# Altium schematic sheet ESP_Mian.SchDoc
size A4
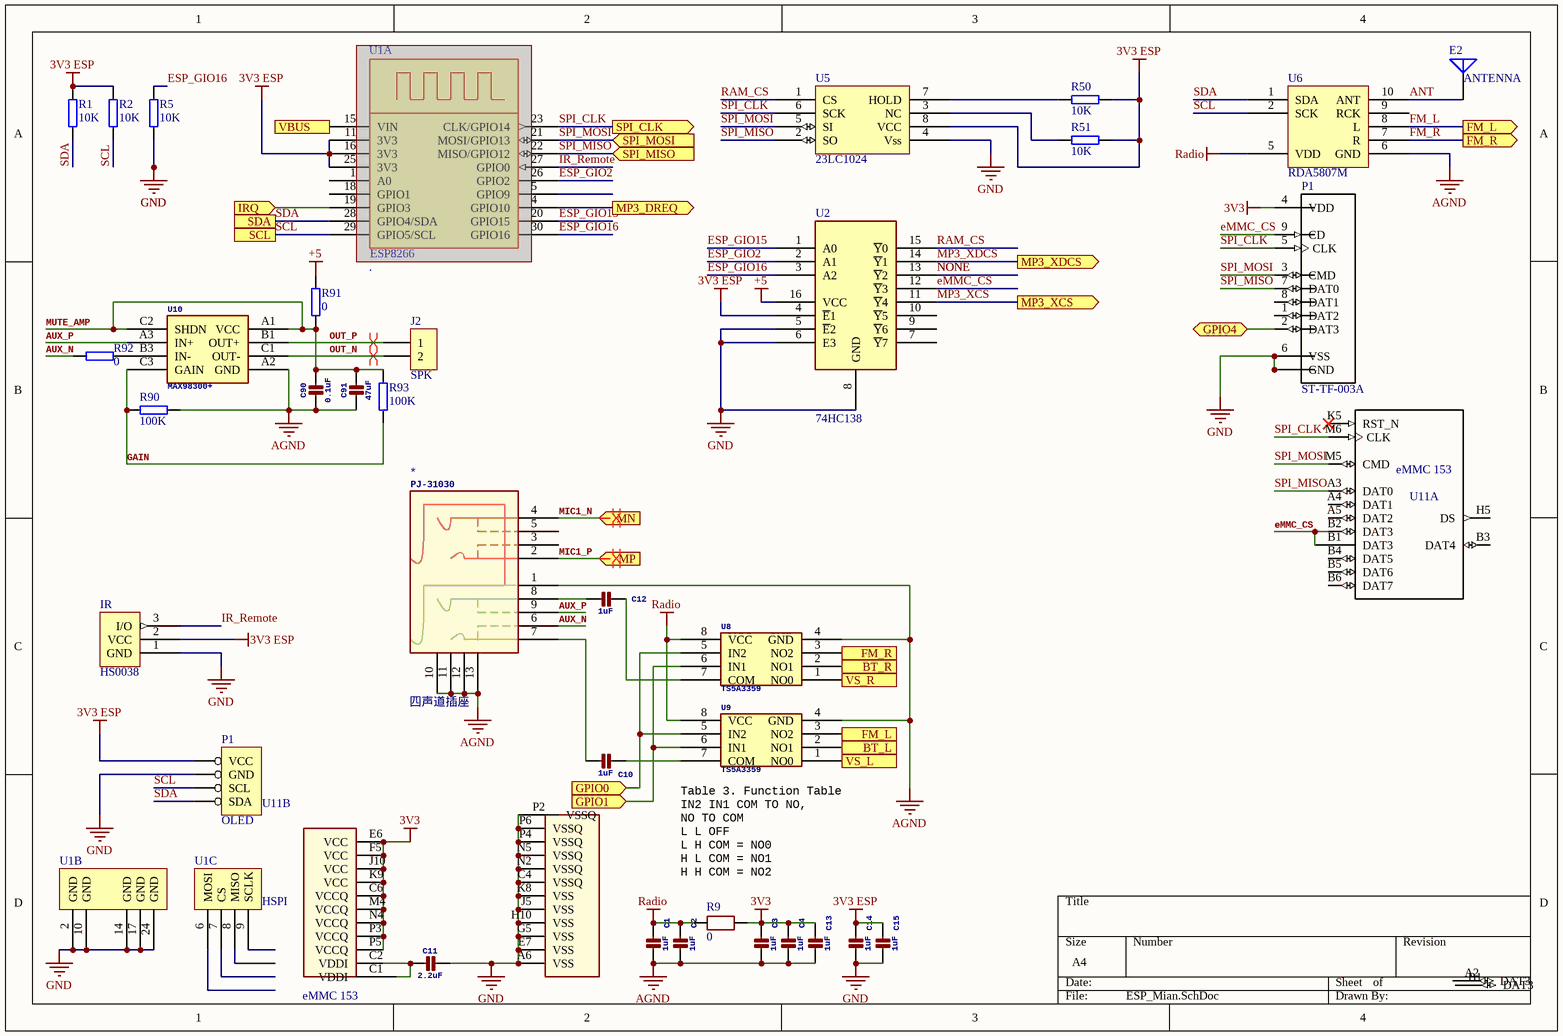
[diagram p0: ESP_Mian.SchDoc]

## Parts
(Parts that share a designator on the sheet are numbered #1, #2 ... from top to bottom, then left to right.)
*  四声道插座  [pj-31030]
C1  1uF  [1206]
C2  1uF  [1206]
C3  1uF  [1206]
C4  1uF  [1206]
C10  1uF  [1206]
C11  2.2uF  [0603]
C12  1uF  [1206]
C13  1uF  [0603AC]
C14  1uF  [1206]
C15  1uF  [1206]
C90  0.1uF  [0201]
C91  47uF  [_0805MP]
E2  ANTENNA  [P125-B]
IR  HS0038  [SIP03]
J2  SPK  [SIP2_1]
P1#1  ST-TF-003A  [*SUNTECH_ST-TF-003A_ST-TF-003A(Primary)]
P1#2  OLED  [SIP4]
R1  10K  [0805]
R2  10K  [0805]
R5  10K  [0603]
R9  0  [0603AR]
R50  10K  [0603]
R51  10K  [0603]
R90  100K  [0201]
R91  0  [0603]
R92  0  [0402]
R93  100K  [0201]
U1  .  [NodeMCU DevKit v1.0 - Inside Labels]  (parts A,B,C of 3)
U2  74HC138  [TSSOP-16]
U5  23LC1024  [SO8NB]
U6  RDA5807M  [RDA5807M]
U8  TS5A3359  [DCU-8N]
U9  TS5A3359  [DCU-8N]
U10  MAX98300+  [WLP-9]
U11  eMMC 153  [BGA153N50P14X14_1300X1150X100N_EM08APGD3-BA000-2(Primary)]  (parts A,B of 2)

## Ports
BT_L (in), BT_R (in), FM_L (in), FM_L (out), FM_R (in), FM_R (out), GPIO0 (in), GPIO1 (in), GPIO4 (bidir), IRQ (in), MN (in), MP3_DREQ (out), MP3_XCS (out), MP3_XDCS (out), MP (in), SCL, SDA, SPI_CLK (out), SPI_MISO (in), SPI_MOSI (in), VBUS (out), VS_L (in), VS_R (in)

## Nets
3V3: C3.1 C4.1 C13.1 P1#1.4(VDD) R9.1 U11.C6(VCCQ) U11.E6(VCC) U11.F5(VCC) U11.J10(VCC) U11.K9(VCC) U11.M4(VCCQ) U11.N4(VCCQ) U11.P3(VCCQ) U11.P5(VCCQ)
3V3 ESP: C14.1 C15.1 IR.2(VCC) P1#2.3(VCC) R1.2 R2.2 R50.1 R51.1 U1.11(3V3) U1.16(3V3) U1.25(3V3) U2.4(~{E}1) U5.8(VCC)
+5: R91.2 U2.16(VCC)
AGND: *.1 *.10 *.11 *.12 *.13 C1.2 C2.2 C3.2 C4.2 C13.2 C90.2 C91.2 R90.2 U6.6(GND) U8.4(GND) U9.4(GND) U10.A2(GND)
GND: C11.1 C14.2 C15.2 IR.1(GND) P1#1.6(VSS) P1#1.G1(GND) P1#1.G2(GND) P1#1.G3(GND) P1#1.G4(GND) P1#2.4(GND) R5.1 U1.2(GND) U1.10(GND) U1.14(GND) U1.17(GND) U1.24(GND) U2.5(~{E}2) U2.6(E3) U2.8(GND) U5.4(Vss) U11.A6(VSS) U11.C4(VSSQ) U11.E7(VSS) U11.G5(VSS) U11.H10(VSS) U11.J5(VSS) U11.K8(VSS) U11.N2(VSSQ) U11.N5(VSSQ) U11.P2(VSSQ) U11.P4(VSSQ) U11.P6(VSSQ)
Radio: C1.1 C2.1 R9.2 U6.5(VDD) U8.8(VCC) U9.8(VCC)
ANT: E2.1(A) U6.10(ANT)
AUX_N: *.6 R92.2
AUX_P: *.9 U10.A3(IN+)
BT_L: U9.2(NO1) ; port BT_L
BT_R: U8.2(NO1) ; port BT_R
eMMC_CS: P1#1.9(CD) U2.12(~{Y}3) U11.B1(DAT3) U11.B2(DAT3)
ESP_GIO2: U1.26(GPIO2) U2.2(A1)
ESP_GIO15: U1.20(GPIO15) U2.1(A0)
ESP_GIO16: R5.2 U1.30(GPIO16) U2.3(A2)
FM_L: U6.8(L) U9.3(NO2) ; port FM_L
FM_R: U6.7(R) U8.3(NO2) ; port FM_R
GAIN: R90.1 R93.2 U10.C3(GAIN)
GPIO0: U8.5(IN2) U9.5(IN2) ; port GPIO0
GPIO1: U8.6(IN1) U9.6(IN1) ; port GPIO1
GPIO4: P1#1.2(DAT3) ; port GPIO4
IR_Remote: IR.3(I/O) U1.27(GPIO0)
IRQ: U1.19(GPIO3) ; port IRQ
MIC1_N: *.4 ; port MN
MIC1_P: *.2 ; port MP
MP3_DREQ: U1.4(GPIO10) ; port MP3_DREQ
MP3_XCS: U2.11(~{Y}4) ; port MP3_XCS
MP3_XDCS: U2.14(~{Y}1) ; port MP3_XDCS
MUTE_AMP: C90.1 C91.1 R91.1 R93.1 U10.A1(VCC) U10.C2(SHDN)
NONE: U2.13(~{Y}2)
OUT_N: J2.1(2) U10.C1(OUT-)
OUT_P: J2.2(1) U10.B1(OUT+)
RAM_CS: U2.15(~{Y}0) U5.1(CS)
SCL: P1#2.2(SCL) R2.1 U1.29(GPIO5/SCL) U6.2(SCK) ; port SCL
SDA: P1#2.1(SDA) R1.1 U1.28(GPIO4/SDA) U6.1(SDA) ; port SDA
SPI_CLK: P1#1.5(CLK) U1.23(CLK/GPIO14) U5.6(SCK) U11.M6(CLK) ; port SPI_CLK
SPI_MISO: P1#1.7(DAT0) U1.22(MISO/GPIO12) U5.2(SO) U11.A3(DAT0) ; port SPI_MISO
SPI_MOSI: P1#1.3(CMD) U1.21(MOSI/GPIO13) U5.5(SI) U11.M5(CMD) ; port SPI_MOSI
VBUS: U1.15(VIN) ; port VBUS
VS_L: U9.1(NO0) ; port VS_L
VS_R: U8.1(NO0) ; port VS_R
Net*_7: *.7 C10.2
Net*_8: *.8 C12.2
NetC10_1: C10.1 U9.7(COM)
NetC11_2: C11.2 U11.C1(VDDI) U11.C2(VDDI)
NetC12_1: C12.1 U8.7(COM)
NetR50_2: R50.2 U5.7(HOLD)
NetR51_2: R51.2 U5.3(NC)
NetR92_1: R92.1 U10.B3(IN-)

Not connected (* = marked no-connect by the designer): * 3 5; P1#1 1(DAT2) 8(DAT1); U1 1(A0) 5(GPIO9) 6(MOSI) 7(CS) 8(MISO) 9(SCLK) 18(GPIO1); U2 7(~{Y}7) 9(~{Y}6) 10(~{Y}5); U6 9(RCK); U11 A2(DAT3) A4(DAT1) A5(DAT2) B3(DAT4) B4(DAT5) B5(DAT6) B6(DAT7) H5(DS) K5(RST_N)*

## Layout directives
differential pair; differential pair class Amplifier: OUT_P
differential pair: MIC1_N, MIC1_P, OUT_N

## Notes on the sheet
- (near U11) Table 3. Function Table
  IN2 IN1 COM TO NO,
  NO TO COM
  L L OFF
  L H COM = NO0
  H L COM = NO1
  H H COM = NO2
- (in symbol ESP8266_Devlop, part A) ESP8266
- (in symbol ESP8266_Devlop, part C) HSPI

## Library data of the parts
* = 四声道插座: PJ-31030
C1 C10-C12 C14 C90 C91 = CAP_CERAMIC_0805MP: Ceramic CapacitorsFor new designs, use the packages preceded by an '_' character since they are more reliable:The following footprints should be used on most boards:For extremely tight-pitch boards where space is at a premium, the following 'micro-pitch' footprints can be used (smaller pads, no silkscreen outline, etc.):; GateName_1: G$1; SymbolName_1: CAPACITOR; DeviceName: _0805MP; LibraryName: microbuilder; DeviceSetName: CAP_CERAMIC
C2-C4 C13 C15 = CAP: Ceramic CapacitorsFor new designs, use the packages preceded by an '_' character since they are more reliable:The following footprints should be used on most boards:For extremely tight-pitch boards where space is at a premium, the following 'micro-pitch' footprints can be used (smaller pads, no silkscreen outline, etc.):; GateName_1: G$1; DeviceName: 0603-NOOUTLINE; DeviceSetName: CAP_CERAMIC; SymbolName_1: CAPACITOR; LibraryName: microbuilder
E2 = ANTENNA: Generic Antenna
J2 = CON2: Connector
P1#1 = ST-TF-003A: Micro SD; MF: Suntech; Package: None; MP: ST-TF-003A; Price: None; Availability: Unavailable; SnapEDA_Link: https://www.snapeda.com/parts/ST-TF-003A/Suntech/view-part/?ref=snap; Value: *
P1#2 = 4 HEADER: 4 Pin Header
R1 R2 R5 R9 R50 R51 R90-R93 = RES2: Resistor
U1 = ESP8266_Devlop
U2 = 74HC138: 3-to-8 line decoder/demultiplexer; inverting
U10 = MAX98300+: Mono 2.6W ClassD Amp.
U11 = eMMC 153: eMMC BGA-153 1.5x13x1.0; MF: Delkin Devices; MP: EM08APGD3-BA000-2; Availability: Unavailable; Price: None; Package: None; SnapEDA_Link: https://www.snapeda.com/parts/EM08APGD3-BA000-2/Delkin%20Devices/view-part/?ref=snap; Value: *